# EasyEDA Pro project 铜管工装.epro

# Schematic Schematic1
Board Name: Board1; Create Date: 2025-10-13; Page Name: P1; Project Name: 铜管工装; Schematic Name: Schematic1; Update Date: 2025-10-13; Company: 嘉立创EDA; Page Size: A4; Version: V1.0
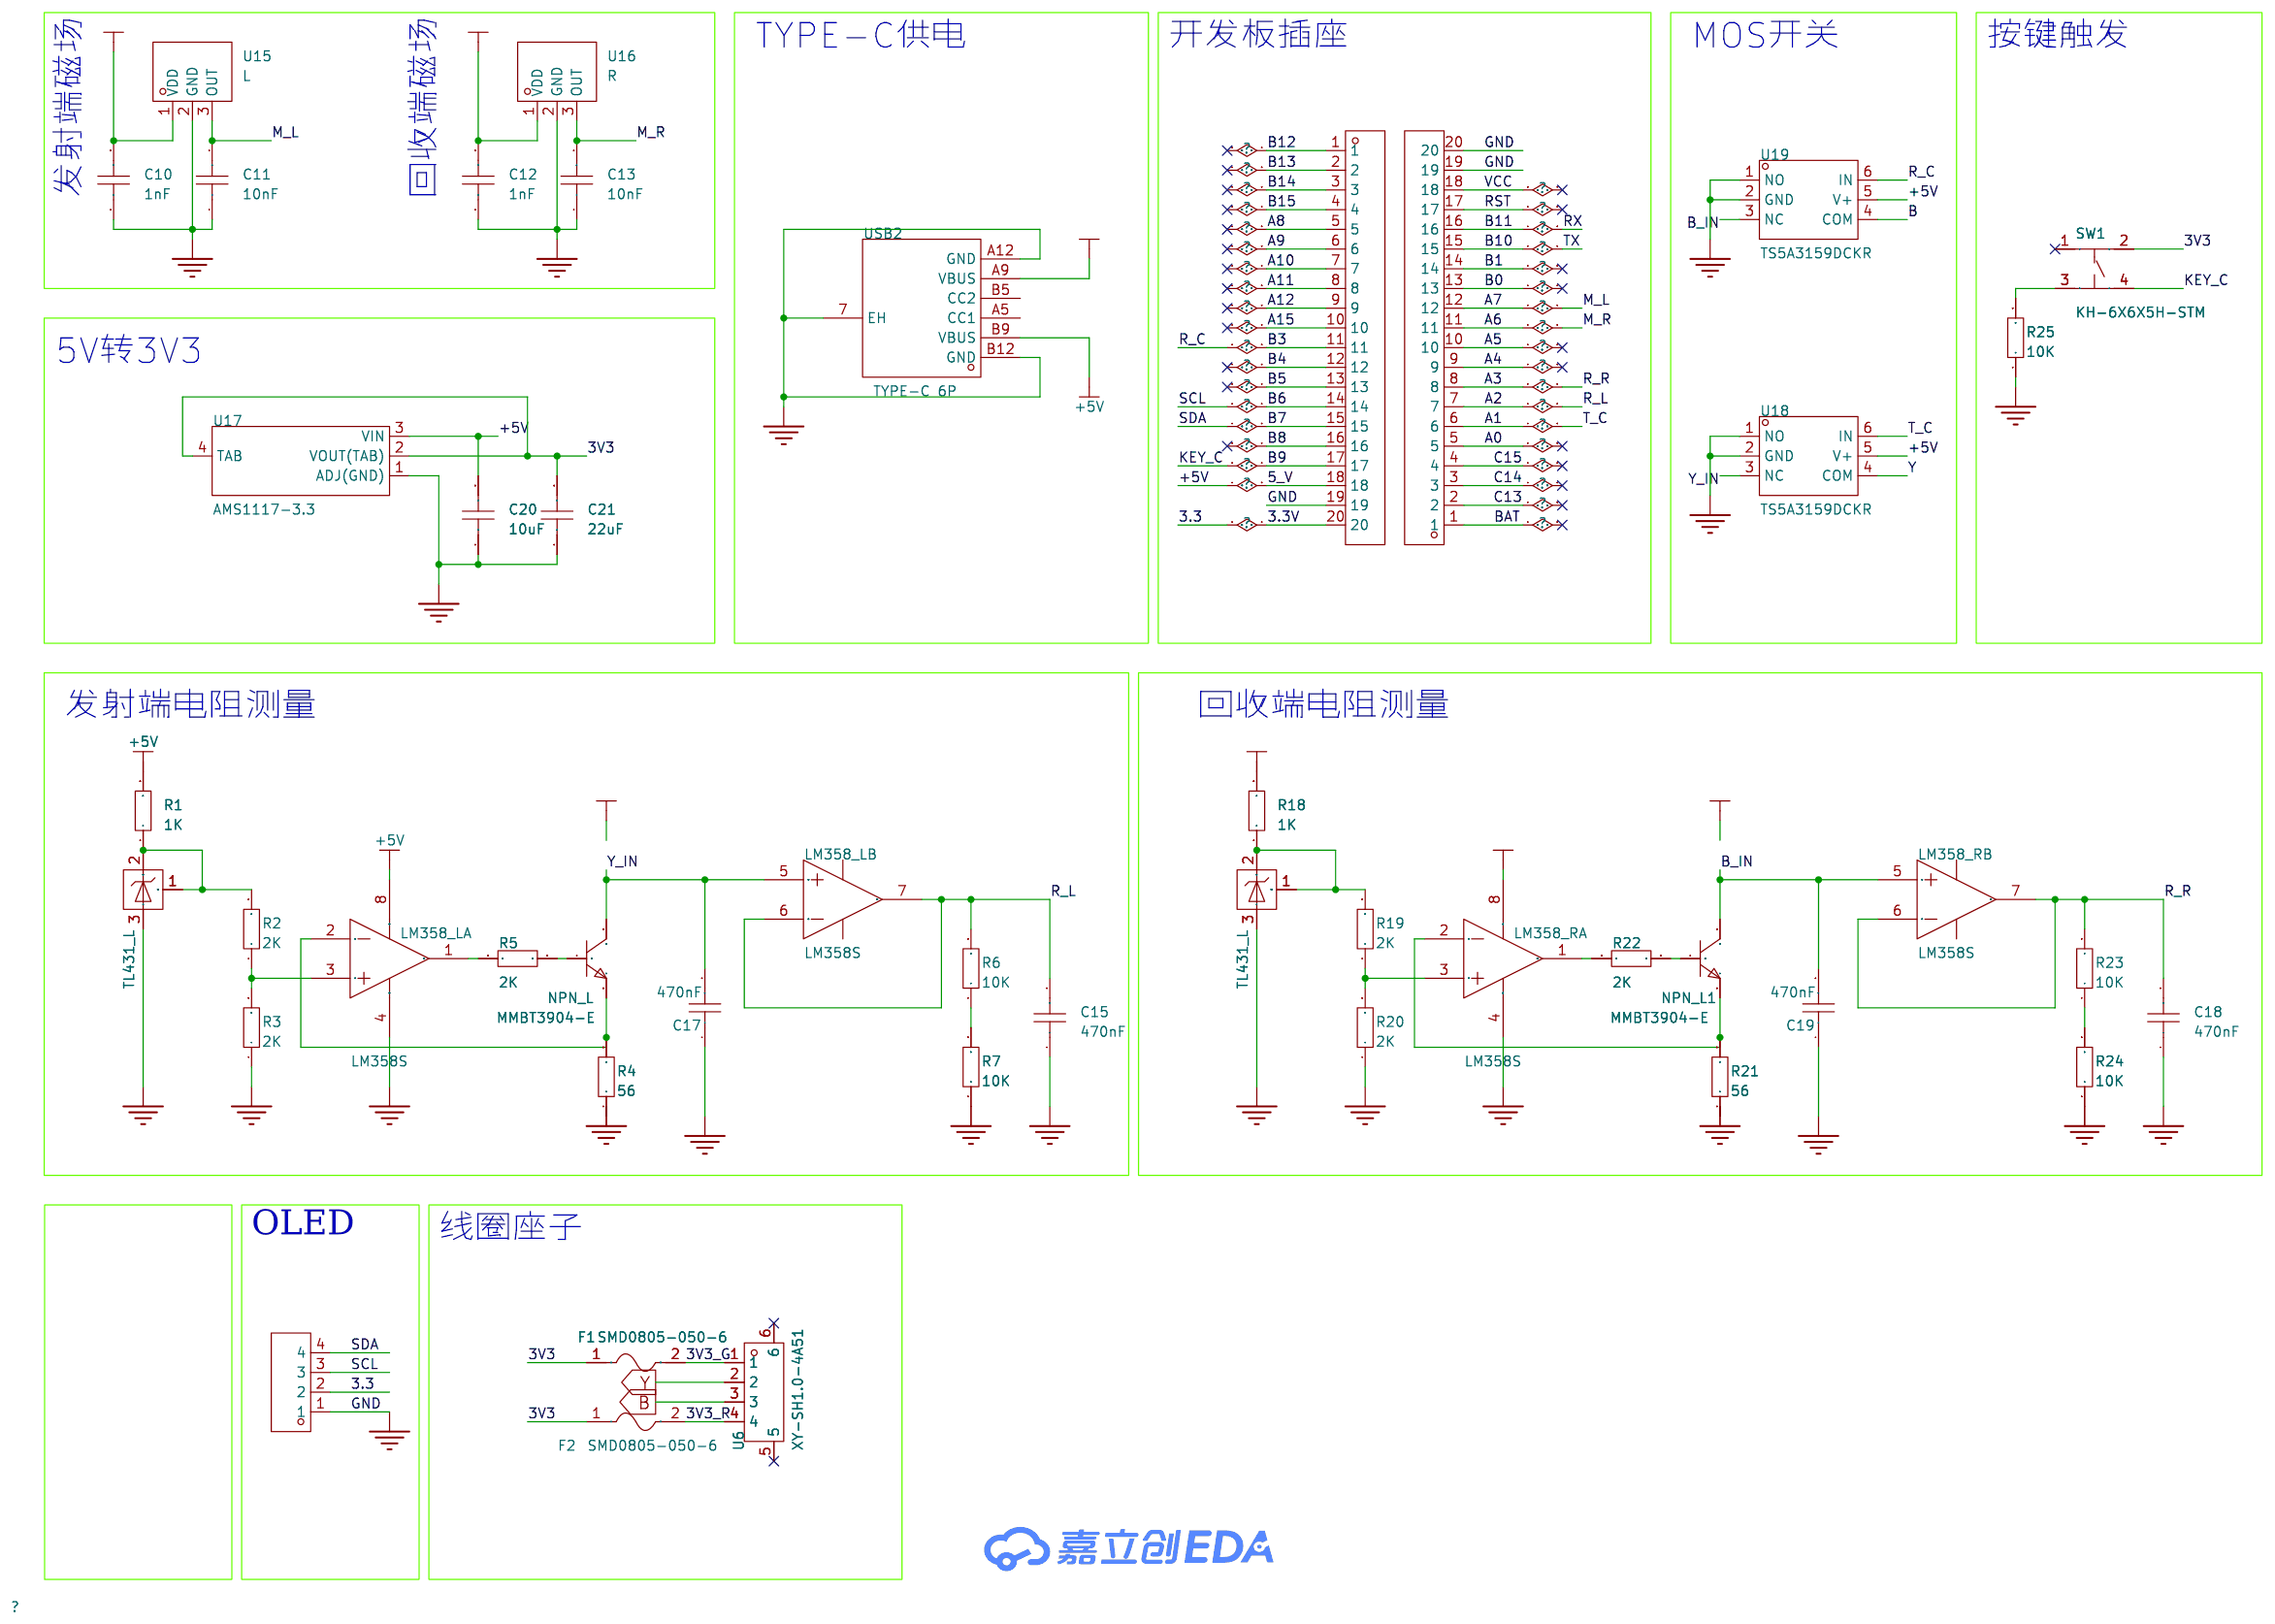
[diagram p0: schematic sheet]

## Parts
C10  1nF  [C0805]
C11  10nF  [C0805]
C12  1nF  [C0805]
C13  10nF  [C0805]
C15  470nF  [C0603]
C17  470nF  [C0603]
C18  470nF  [C0603]
C19  470nF  [C0603]
C20  10uF  [C0805]
C21  22uF  [C0805]
F1  SMD0805-050-6  [F0805]
F2  SMD0805-050-6  [F0805]
H1  2.54-1*4P母  [HDR-TH_4P-P2.54-V-F]
LM358_L  LM358S  [SOP-8_L4.9-W3.9-P1.27-LS6.0-BL]  (sections 1,2)
LM358_R  LM358S  [SOP-8_L4.9-W3.9-P1.27-LS6.0-BL]  (sections 1,2)
NPN_L  MMBT3904-E  [SOT-23-3_L2.9-W1.4-P1.90-LS2.5-BR]
NPN_L1  MMBT3904-E  [SOT-23-3_L2.9-W1.4-P1.90-LS2.5-BR]
R1  1K  [R0603]
R2  2K  [R0603]
R3  2K  [R0603]
R4  56  [R0603]
R5  2K  [R0603]
R6  10K  [R0603]
R7  10K  [R0603]
R18  1K  [R0603]
R19  2K  [R0603]
R20  2K  [R0603]
R21  56  [R0603]
R22  2K  [R0603]
R23  10K  [R0603]
R24  10K  [R0603]
R25  10K  [R0805_1]
SW1  KH-6X6X5H-STM  [SW-SMD_4P-L6.0-W6.0-P4.50-LS9.0_H5.0]
TL431_L  TL431_L  [SOT-23-3_L2.9-W1.4-P1.90-LS2.5-BR]
TL431_L1  TL431_L  [SOT-23-3_L2.9-W1.4-P1.90-LS2.5-BR]
U6  XY-SH1.0-4A51  [CONN-SMD_4P-P1.00_XY-SH1.0-4A51]
U11  KH-2.54FH-1X20P-H8.5  [HDR-TH_20P-P2.54-V-F-2]
U12  KH-2.54FH-1X20P-H8.5  [HDR-TH_20P-P2.54-V-F-2]
U15  L  [TO-92S-3_L4.1-W1.7-P1.27-L]
U16  R  [TO-92S-3_L4.1-W1.7-P1.27-L]
U17  AMS1117-3.3  [SOT-223-4_L6.5-W3.5-P2.30-LS7.0-BR]
U18  TS5A3159DCKR  [SC-70-6_L2.0-W1.3-P0.65-LS2.1-BL-1]
U19  TS5A3159DCKR  [SC-70-6_L2.0-W1.3-P0.65-LS2.1-BL-1]
USB2  TYPE-C 6P  [TYPE-C-SMD_TYPE-C-6P]

## Library data of the parts
C10-C13 C15 C17-C21 = CAP_0603: Supplier Footprint: 0603
F1 F2 = SMD0805-050-6: 耐压(Vmax):6V;最大电流(Imax):40A;保持电流(Ihold):500mA;跳闸电流(Itrip):1A;; Supplier Part: C46640983; Manufacturer: 宏嘉诚; Supplier Footprint: 0805; JLCPCB Part Class: 扩展库; Datasheet: https://item.szlcsc.com/datasheet/SMD0805-050-6/48798689.html; Supplier: LCSC; Voltage - Max: 6V; Current - Max: 40A; Hold Current: 500mA; Trip Current: 1A; Power Dissipation: 500mW; Resistance - Initial (Ri) (Min): 100mΩ; Resistance - Post Trip (R1) (Max): 850mΩ; Time to Trip(Max): 100ms; Operating Temperature: -40℃~+85℃; Length: 2.2mm; Width: 1.5mm; Height: 0.8mm
H1 = 2.54-1*4P母: 插孔结构:1x4P;间距:2.54mm;行距:-;圆孔/方孔:方孔;安装类型:直插;排数:单排;总孔位数:4P;额定电流:3A;额定电压:-;插孔方向:顶部;塑高:-;触头材质:青铜;触头镀层:-;工作温度范围:-40℃~+105℃;焊接温度(最大值):-;; LCSC Part Name: 间距:2.54mm 1x4P 直插; Supplier Part: C2718488; Manufacturer: BOOMELE(博穆精密); Supplier Footprint: 插件,P=2.54mm; Datasheet: https://atta.szlcsc.com/upload/public/pdf/source/20210301/C2718488_F4427B881E42CAA8DDB0B1C12B3A522C.pdf; Supplier: LCSC; Holes Structure: 1x4P; Pitch: 2.54mm; Circular Hole / Square Hole: 方孔; Mounting Type: 直插; Number of Rows: 单排; Number of Holes: 4P; Current Rating (Max): 3A; Holes Direction: 顶部; Contact Material: 青铜; Operating Temperature Range: -40℃~+105℃
LM358_L LM358_R = LM358S_C408270: 放大器数:双路;轨到轨:-;增益带宽积(GBP):1MHz;压摆率(SR):0.3V/us;; Supplier Part: C408270; Manufacturer: Slkor(萨科微); Supplier Footprint: SOP-8; JLCPCB Part Class: 扩展库; Datasheet: https://atta.szlcsc.com/upload/public/pdf/source/20190729/C408270_8A571363543B0DAC89A7C1628AEF28C4.pdf; Supplier: LCSC; Number of Circuits: 双路; Maximum Power Supply Range (Vdd-Vss): 36V; Gain Bandwidth Product(GBP): 1MHz; Input Offset Voltage Drift (Vos TC): 7uV/℃; Slew Rate(SR): 0.3V/us; Common Mode Rejection Ratio (CMRR): 80dB; Operating Temperature: 0℃~+70℃
NPN_L NPN_L1 = MMBT3904-E: 晶体管类型:-;集电极电流(Ic):-;集射极击穿电压(Vceo):-;功率(Pd):-;直流电流增益(hFE@Ic,Vce):-;; LCSC Part Name: 三极管(BJT); Supplier Part: C41371422; Manufacturer: MDD(辰达半导体); Supplier Footprint: SOT-23; JLCPCB Part Class: 扩展库; Datasheet: https://atta.szlcsc.com/upload/public/pdf/source/20240830/279C69FABDBFBB30A5CB11E9EEA12008.pdf; Supplier: LCSC
R1-R7 R18-R25 = Res_0603: Supplier Footprint: 0603
SW1 = KH-6X6X5H-STM: 电路结构:单刀单掷;按钮形状:圆形按钮;安装方式:立贴;开关长度:6mm;开关宽度:6mm;开关高度:5mm;带支架:不带支架;触点电流:50mA;额定电压:12V;工作寿命:8万次;; LCSC Part Name: 6*6*5mm 立贴 轻触开关; Supplier Part: C2837531; Manufacturer: kinghelm(金航标); Supplier Footprint: SMD-4P,6x6mm; JLCPCB Part Class: 扩展库; Datasheet: https://item.szlcsc.com/datasheet/KH-6X6X5H-STM/3009601.html; Supplier: LCSC; Circuit: 单刀单掷; Actuator Style: 圆形按钮; Mounting Type: 立贴; Length: 6mm; Width: 6mm; Switch Height: 5mm; with Bracket: 不带支架; Contact Current: 50mA; Voltage Rating: 12V; Actuator/Cap Color: 黑色; Termination Style: 鸥翼型; Life: 8万次
TL431_L TL431_L1 = TL431A-MS: 输出类型:可调;输入电压:-;输出电压:2.5V~36V;输出电流:100mA;精度:±0.5%;; LCSC Part Name: 电压:2.495V~36V 电流:100mA ±0.5%; Supplier Part: C19272793; Manufacturer: MSKSEMI(美森科); Supplier Footprint: SOT-23; JLCPCB Part Class: 扩展库; Datasheet: https://atta.szlcsc.com/upload/public/pdf/source/20231208/1CED24ED5F4ADB4233DAC99CE708398F.pdf; Supplier: LCSC; Output Type: 可调; Output Voltage: 2.5V~36V; Output Current: 100mA; Tolerance: ±0.5%; Temperature Coefficient: 25ppm/℃
U6 = XY-SH1.0-4A51: 插针结构:1x4P;间距:1mm;安装方式:立贴;总PIN数:4P;排数:1;每排PIN数:4;; LCSC Part Name: 间距:1.0 1x4P 立贴; Supplier Part: C19272007; Manufacturer: XYECONN(辛译); Supplier Footprint: SMD,P=1mm; JLCPCB Part Class: Extended Part; Datasheet: https://atta.szlcsc.com/upload/public/pdf/source/20231128/C6B60C64F4338683BC8BC065CCF39725.pdf; Supplier: LCSC; Pins Structure: 1x4P; Pitch: 1mm; Mounting Style: 立贴; Number of Pins: 4P; Number of Rows: 1; Number of PINs Per Row: 4
U11 U12 = KH-2.54FH-1X20P-H8.5: 插孔结构:1x20P;间距:2.54mm;行距:-;圆孔/方孔:方孔;安装类型:直插;排数:单排;总孔位数:20P;额定电流:3A;额定电压:-;插孔方向:顶部;塑高:8.5mm;工作温度范围:-40℃~+105℃;; LCSC Part Name: 间距:2.54mm 1x20P 直插; Supplier Part: C2905423; Manufacturer: kinghelm(金航标); Supplier Footprint: 插件,P=2.54mm; Datasheet: https://atta.szlcsc.com/upload/public/pdf/source/20211019/BDB673907948473CE61C8A1CF06C5BF5.pdf; Supplier: LCSC; Holes Structure: 1x20P; Pitch: 2.54mm; Circular Hole / Square Hole: 方孔; Mounting Type: 直插; Number of Rows: 单排; Number of Holes: 20P; Current Rating (Max): 3A; Holes Direction: 顶部; Insulation Height: 8.5mm; Operating Temperature Range: -40℃~+105℃
U15 U16 = HX6639IUA-D: 测位移,测角度,测磁场变化,测电流; LCSC Part Name: 高灵敏度线性霍尔元件 线性霍尔传感器; Supplier Part: C558885; Manufacturer: HUAXIN(华芯); Supplier Footprint: TO-92S; JLCPCB Part Class: 扩展库; Datasheet: https://atta.szlcsc.com/upload/public/pdf/source/20240416/3C8E9329C72945CE95B7A864F22507C2.pdf; Supplier: LCSC; supply voltage: 2.8V~6V; Operating Temperature: -40℃~+125℃
U17 = AMS1117-3.3_C347222: 输出类型:固定;工作电压:12V;输出电压:3.3V;输出电流:1A;电源纹波抑制比(PSRR):60dB@(120Hz);输出极性:正极;; LCSC Part Name: 输出:3.3V 电流:1A 耐压:12V; Supplier Part: C347222; Manufacturer: UMW(友台半导体); Supplier Footprint: SOT-223; JLCPCB Part Class: 扩展库; Datasheet: https://item.szlcsc.com/datasheet/AMS1117-3.3/323882.html; Supplier: LCSC; Output Type: 固定; Voltage - Supply: 12V; Output Voltage: 3.3V; Output Current: 1A; Power Supply Rejection Ratio (PSRR): 60dB@(120Hz); Voltage Dropout: 1.3V@(1A); Features: 过流保护; Output Configuration: 正极; Number of Outputs: 1
U18 U19 = TS5A3159DCKR: 开关电路:2:1;通道数:1;导通电阻(Ron):1Ω;; LCSC Part Name: TS5A3159 1-Q SPDT 模拟开关; Supplier Part: C46388; Manufacturer: TI(德州仪器); Supplier Footprint: SC-70-6(SOT-363); JLCPCB Part Class: 扩展库; Datasheet: https://www.ti.com/cn/lit/gpn/ts5a3159; Supplier: LCSC; Switch Circuit: 2:1; Number of Channels: 1; Voltage - Supply: 1.65V~5.5V; Turn-on time: 20ns; Ron: 1Ω; Turn-off time: 15ns; Operating Temperature: -40℃~+85℃; Con: 84pF; Bandwidth: 100MHz
USB2 = TYPE-C 6P: 连接器类型:Type-C;标准:USB 3.1;公母:母;安装方式:卧贴;触点数量:6P;端口数量:1;额定电流 - 电源:5A;工作温度范围:-40℃~+85℃;; LCSC Part Name: Type-C 母 卧贴; Supplier Part: C456012; Manufacturer: SHOU HAN(首韩); Supplier Footprint: SMD; JLCPCB Part Class: 扩展库; Datasheet: https://atta.szlcsc.com/upload/public/pdf/source/20201203/C456012_B13F72044DF846EDBE9BDD0D1D3CD166.pdf; Supplier: LCSC; Connector Type: Type-C; Standard: USB 3.1; Gender: 母; Mounting Style: 卧贴; Number of Contacts: 6P; Number of Ports: 1; Current Rating - Power (Max): 5A; Operating Temperature Range: -40℃~+85℃; Rated Voltage (Max): 20V; Connect-Disconnect Life: 3千次; Core Colour: 黑色

## Nets
3V3: C10.2 C12.2 C21.2 F1.1 F2.1 SW1.2 U15.1(VDD) U16.1(VDD) U17.2(VOUT(TAB)) U17.4(TAB)
3V3_G: F1.2 U6.1
3V3_R: F2.2 U6.4
5V: LM358_R.8(VCC) R18.2 USB2.A9(VBUS)
+5V: C20.2 LM358_L.8(VCC) R1.2 U11.18 U17.3(VIN) U18.5(V+) U19.5(V+) USB2.B9(VBUS)
GND: C10.1 C11.1 C12.1 C13.1 C15.1 C17.1 C18.1 C19.1 C20.1 C21.1 H1.1 LM358_L.4(GND) LM358_R.4(GND) R3.1 R4.1 R7.1 R20.1 R21.1 R24.1 R25.1 TL431_L.3(A) TL431_L1.3(A) U11.19 U12.19 U12.20 U15.2(GND) U16.2(GND) U17.1(ADJ(GND)) U18.1(NO) U18.2(GND) U19.1(NO) U19.2(GND) USB2.7(EH) USB2.A12(GND) USB2.B12(GND)
VCC: U12.18
3.3: H1.2 U11.20
A0: U12.5
A1: U12.6 U18.6(IN)
A2: C15.2 LM358_L.6(IN2-) LM358_L.7(OUT2) R6.2 U12.7
A3: C18.2 LM358_R.6(IN2-) LM358_R.7(OUT2) R23.2 U12.8
A4: U12.9
A5: U12.10
A6: C13.2 U12.11 U16.3(OUT)
A7: C11.2 U12.12 U15.3(OUT)
A8: U11.5
A9: U11.6
A10: U11.7
A11: U11.8
A12: U11.9
A15: U11.10
B: U6.3 U19.4(COM)
B0: U12.13
B1: U12.14
B3: U11.11 U19.6(IN)
B4: U11.12
B5: U11.13
B6: H1.3 U11.14
B7: H1.4 U11.15
B8: U11.16
B9: SW1.4 U11.17
B10: U12.15
B11: U12.16
B12: U11.1
B13: U11.2
B14: U11.3
B15: U11.4
B_IN: C19.2 LM358_R.5(IN2+) NPN_L1.3(C) U19.3(NC)
BAT: U12.1
C13: U12.2
C14: U12.3
C15: U12.4
RST: U12.17
Y: U6.2 U18.4(COM)
Y_IN: C17.2 LM358_L.5(IN2+) NPN_L.3(C) U18.3(NC)
$1N2206: NPN_L.1(B) R5.2
$1N2855: R6.1 R7.2
$1N3044: LM358_L.1(OUT1) R5.1
$1N49015: R1.1 R2.2 TL431_L.1(REF) TL431_L.2(C)
$1N49740: NPN_L1.1(B) R22.2
$1N49741: R23.1 R24.2
$1N49768: LM358_R.1(OUT1) R22.1
$1N49771: R18.1 R19.2 TL431_L1.1(REF) TL431_L1.2(C)
$1N53499: LM358_L.2(IN1-) NPN_L.2(E) R4.2
$1N53519: LM358_L.3(IN1+) R2.1 R3.2
$1N53536: LM358_R.3(IN1+) R19.1 R20.2
$1N53543: LM358_R.2(IN1-) NPN_L1.2(E) R21.2
$1N65504: R25.2 SW1.3

Not connected (* = marked no-connect by the designer): SW1 1*; U6 5* 6*; USB2 A5(CC1) B5(CC2)

## Notes on the sheet
- TYPE-C供电
- 开发板插座
- MOS开关
- 按键触发
- 发射端磁场
- 回收端磁场
- 5V转3V3
- 发射端电阻测量
- 回收端电阻测量
- OLED
- 线圈座子

# Board PCB1
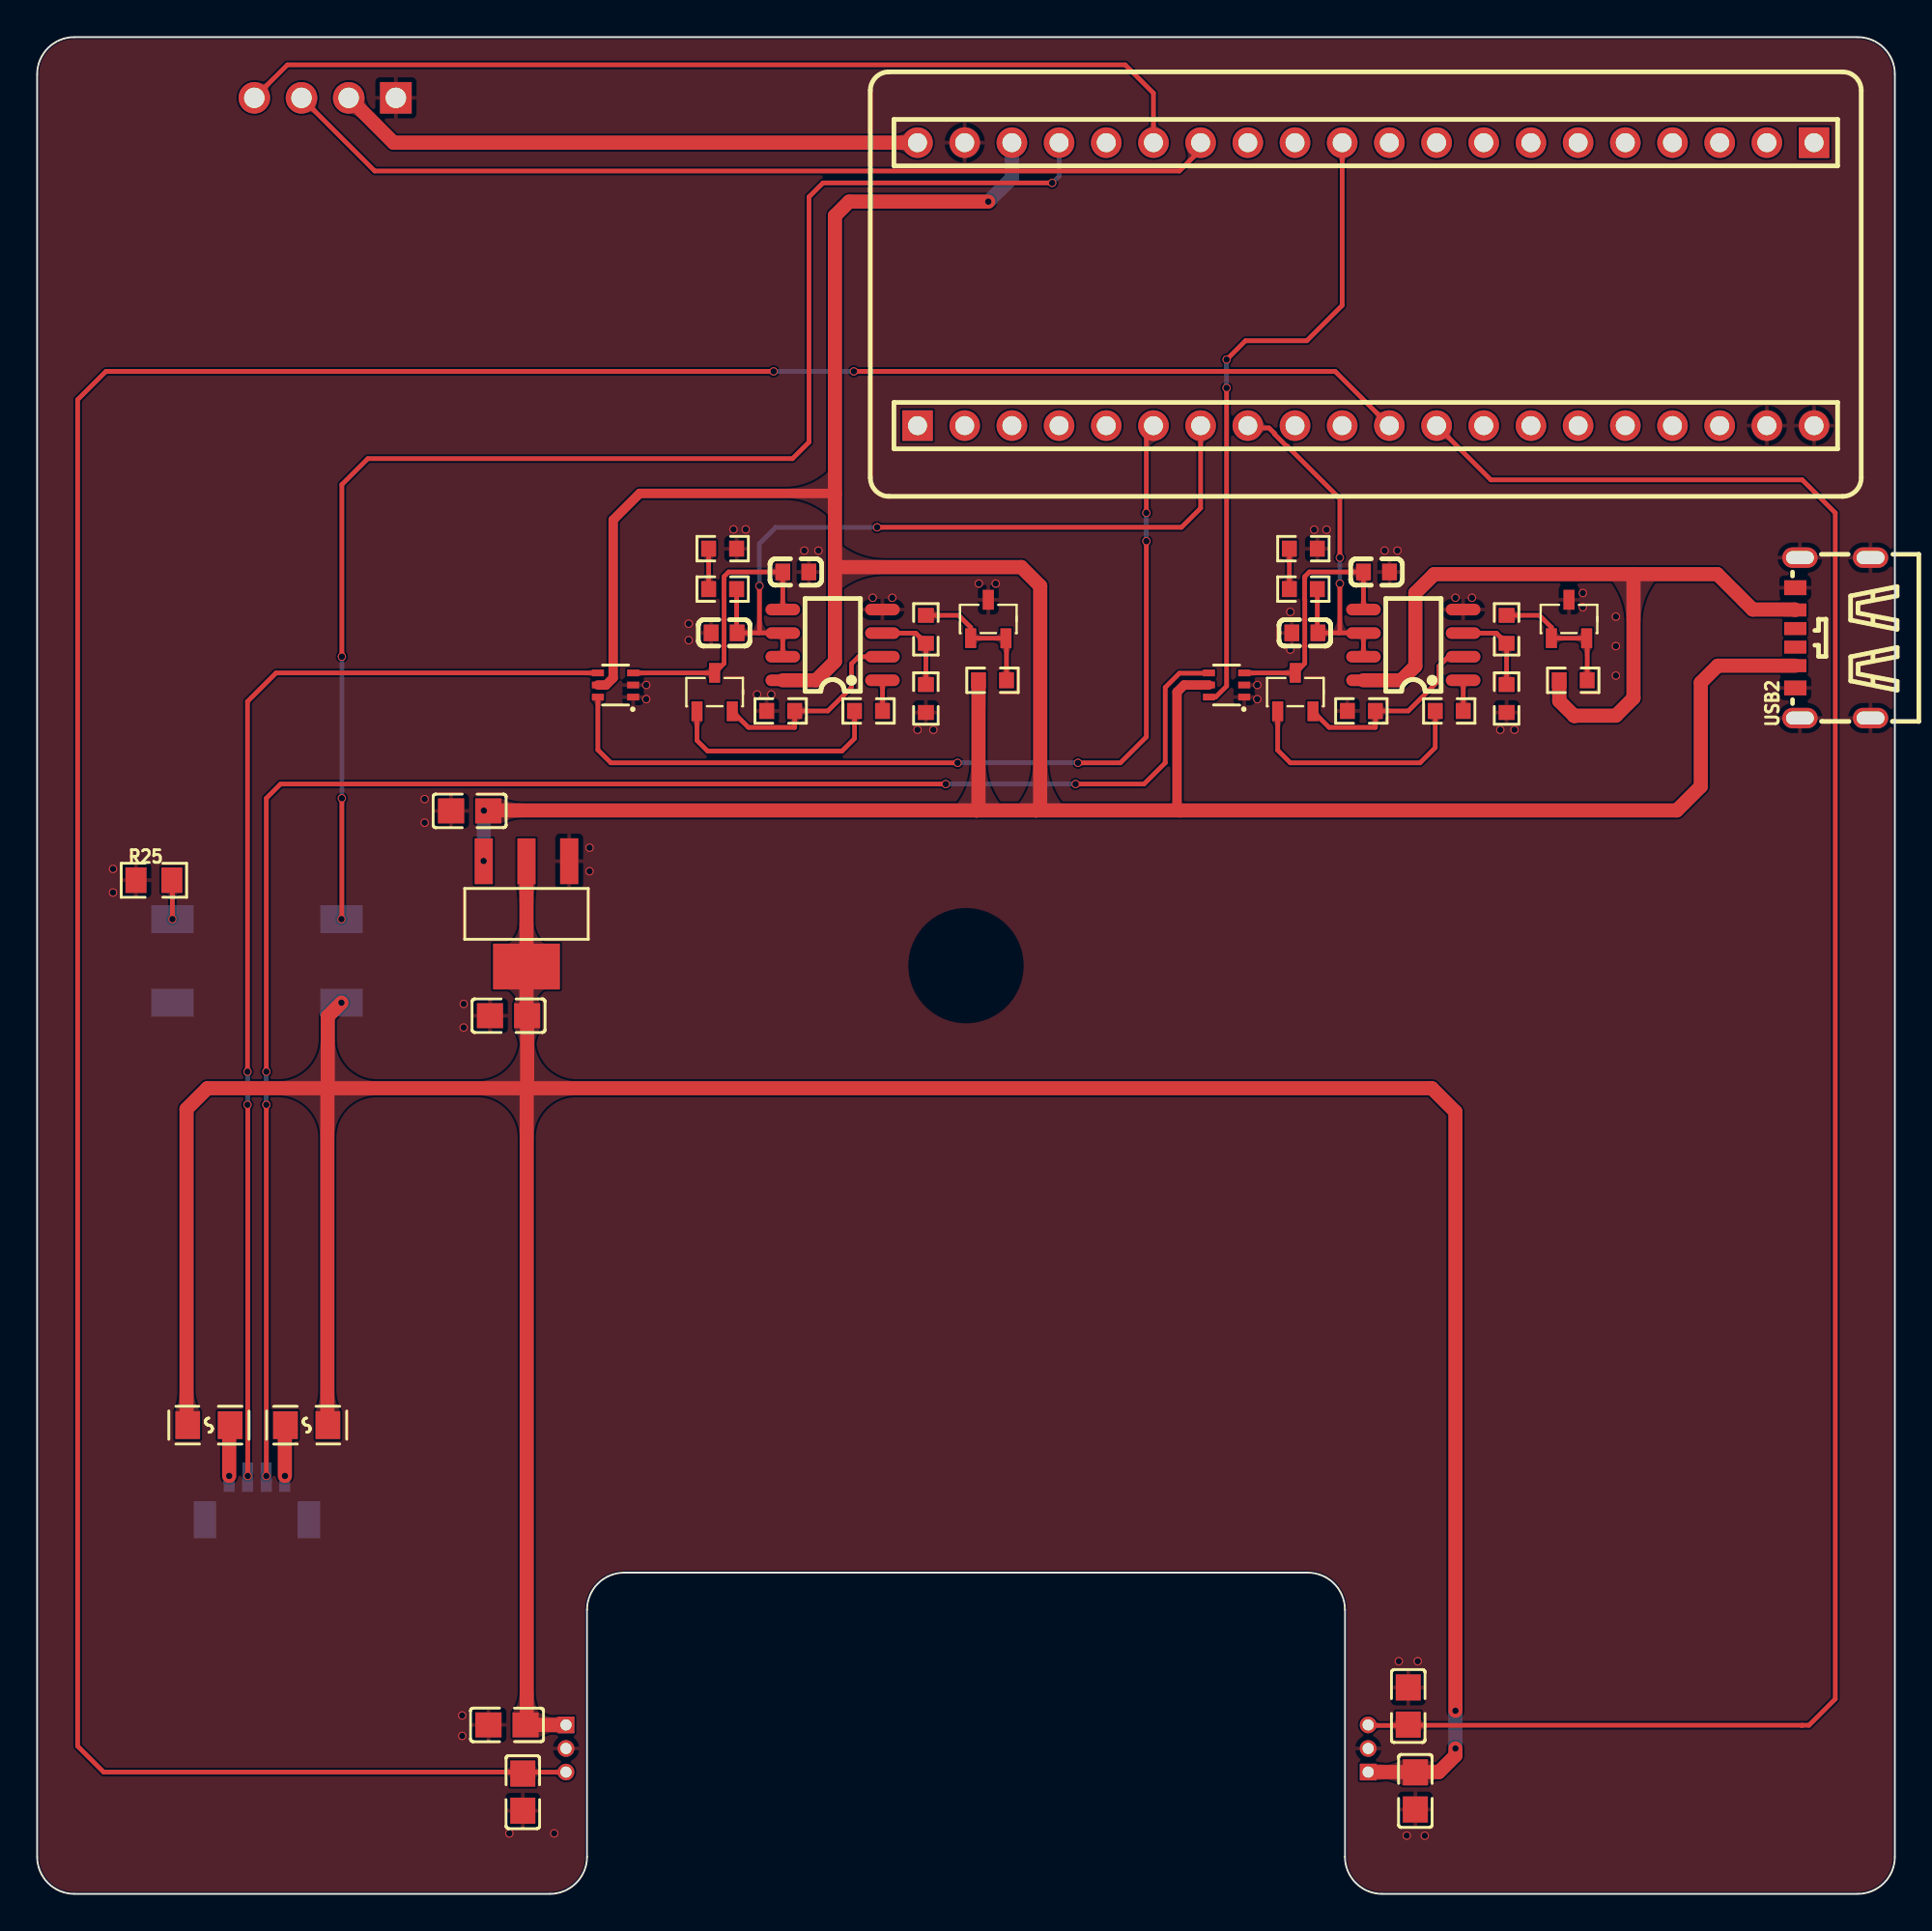
[diagram p1: board, top side]
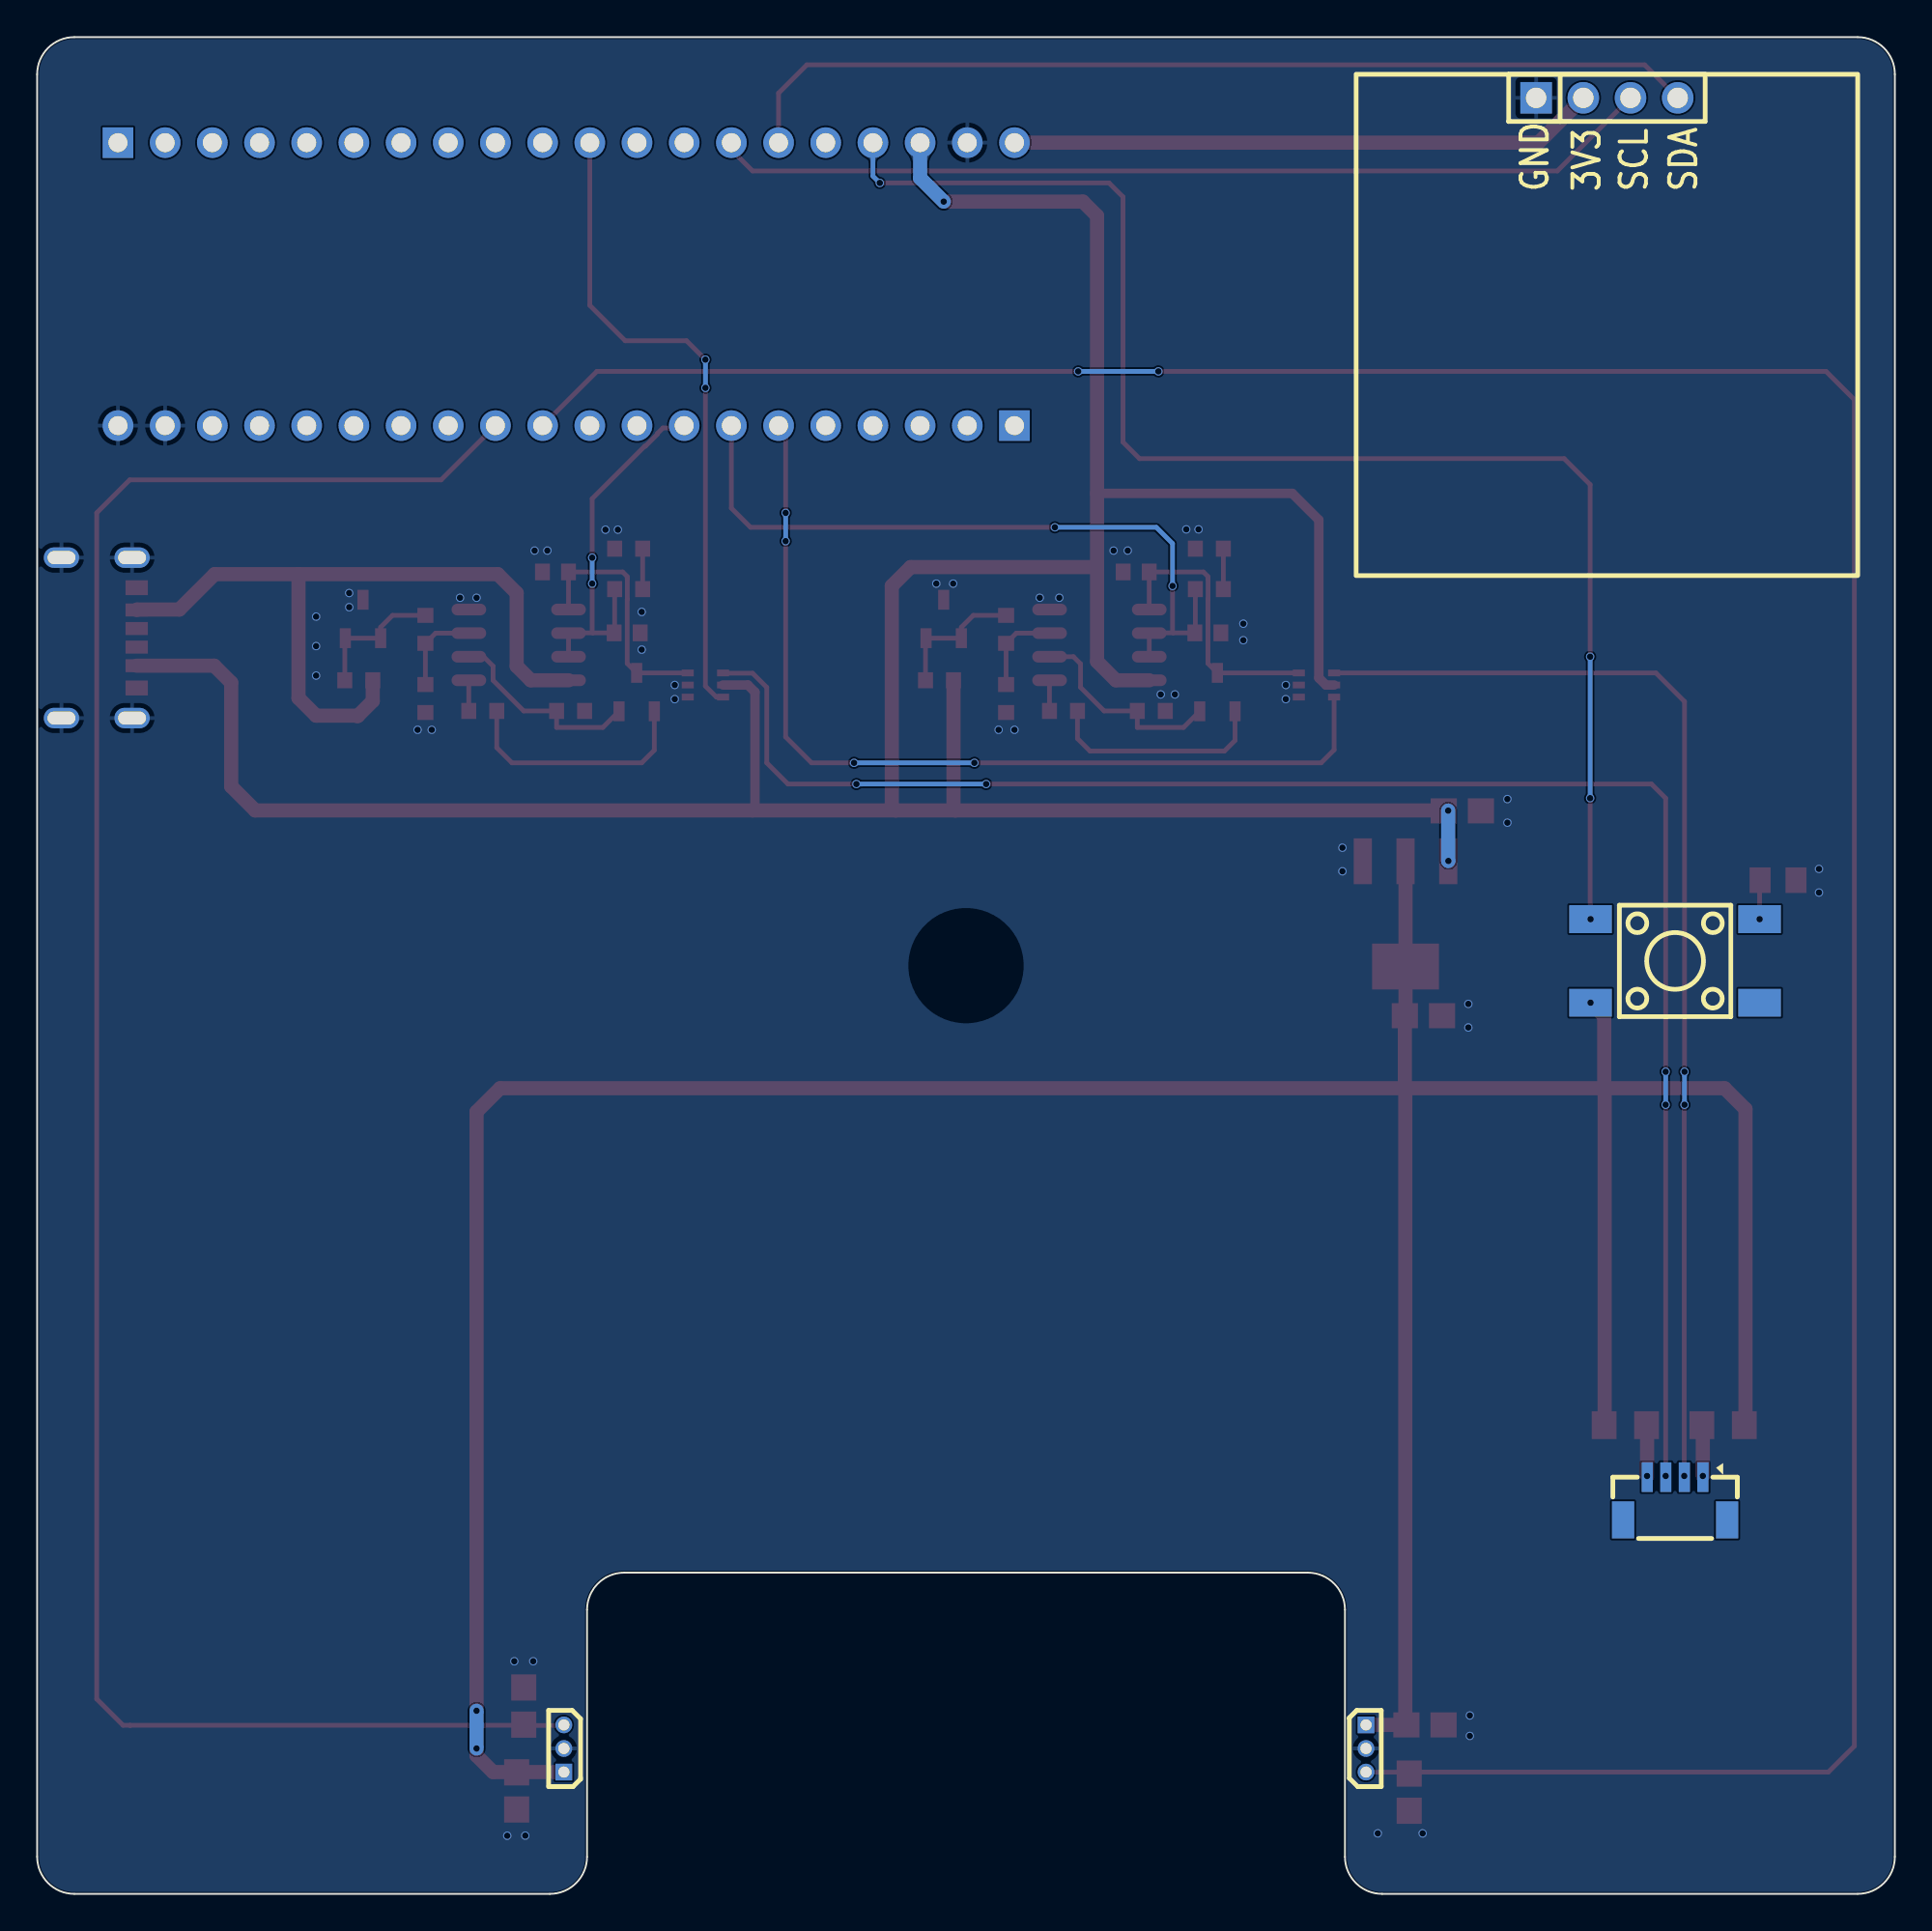
[diagram p2: board, bottom side, seen from below]

Outline 100 x 100 mm; copper layers: Top Layer, Bottom Layer. Coordinates in mm from the lower left corner of the outline.
Outline path: 0,98 arc(0.59,99.41) 2,100 98,100 arc(99.41,99.41) 100,98 100,2 arc(99.41,0.59) 98,0 72.4,0 arc(70.99,0.59) 70.4,2 70.4,15.3 arc(69.81,16.71) 68.4,17.3 31.6,17.3 arc(30.19,16.71) 29.6,15.3 29.6,2 arc(29.01,0.59) 27.6,0 2,0 arc(0.59,0.59) 0,2 0,98
Stack: Top Layer 0.035mm / Dielectric1 1.51mm FR4 er 4.5 / Bottom Layer 0.035mm

## Design rules (mm)
template: 自定义配置
spacing copperThickness1oz (default): track to track 0.102, other pairs 0.152 to 0.3
spacing copperThickness2oz: track to track 0.203, other pairs 0.152 to 0.3
track width copperThickness1oz (default): min 0.127, default 0.254, max 2.54
track width copperThickness2oz: min 0.127, default 0.254, max 2.54
differential pair differentialPair (default): width min 0.127, default 0.254, max 2.54; gap min 0.152, default 0.152
via viaSize (default): diameter min 0.1, default 0.45, max 10; hole min 0.1, default 0.35, max 6.3

## Placement (name value [footprint] x y rotation side)
C10  1nF  [C0805]  25.29 9.1 0 top
C11  10nF  [C0805]  73.81 10.12 270 top
C12  1nF  [C0805]  74.19 5.54 90 top
C13  10nF  [C0805]  26.14 5.48 90 top
C15  470nF  [C0603]  36.98 67.91 0 top
C17  470nF  [C0603]  40.84 71.19 180 top
C18  470nF  [C0603]  68.24 67.91 0 top
C19  470nF  [C0603]  72.1 71.19 180 top
C20  10uF  [C0805]  23.28 58.33 0 top
C21  22uF  [C0805]  25.38 47.3 0 top
F1  SMD0805-050-6  [F0805]  9.25 25.24 0 top
F2  SMD0805-050-6  [F0805]  14.51 25.24 180 top
H1  2.54-1*4P母  [HDR-TH_4P-P2.54-V-F]  15.5 96.73 180 bottom
LM358_L  LM358S  [SOP-8_L4.9-W3.9-P1.27-LS6.0-BL]  42.82 67.27 90 top
LM358_R  LM358S  [SOP-8_L4.9-W3.9-P1.27-LS6.0-BL]  74.08 67.27 90 top
NPN_L  MMBT3904-E  [SOT-23-3_L2.9-W1.4-P1.90-LS2.5-BR]  36.47 64.73 270 top
NPN_L1  MMBT3904-E  [SOT-23-3_L2.9-W1.4-P1.90-LS2.5-BR]  67.73 64.73 270 top
R1  1K  [R0603]  51.43 65.36 180 top
R2  2K  [R0603]  47.84 68.1 90 top
R3  2K  [R0603]  47.84 64.38 90 top
R4  56  [R0603]  40.02 63.71 0 top
R5  2K  [R0603]  44.75 63.71 180 top
R6  10K  [R0603]  36.9 70.27 0 top
R7  10K  [R0603]  36.9 72.45 180 top
R18  1K  [R0603]  82.69 65.36 180 top
R19  2K  [R0603]  79.1 68.1 90 top
R20  2K  [R0603]  79.1 64.38 90 top
R21  56  [R0603]  71.28 63.71 0 top
R22  2K  [R0603]  76.01 63.71 180 top
R23  10K  [R0603]  68.16 70.27 0 top
R24  10K  [R0603]  68.16 72.45 180 top
R25  10K  [R0805_1]  6.29 54.6 0 top
SW1  KH-6X6X5H-STM  [SW-SMD_4P-L6.0-W6.0-P4.50-LS9.0_H5.0]  11.83 50.25 0 bottom
TL431_L  TL431_L  [SOT-23-3_L2.9-W1.4-P1.90-LS2.5-BR]  51.2 68.66 270 top
TL431_L1  TL431_L  [SOT-23-3_L2.9-W1.4-P1.90-LS2.5-BR]  82.46 68.66 270 top
U6  XY-SH1.0-4A51  [CONN-SMD_4P-P1.00_XY-SH1.0-4A51]  11.83 21.29 0 bottom
U11  KH-2.54FH-1X20P-H8.5  [HDR-TH_20P-P2.54-V-F-2]  71.52 94.32 180 top
U12  KH-2.54FH-1X20P-H8.5  [HDR-TH_20P-P2.54-V-F-2]  71.52 79.08 0 top
U15  L  [TO-92S-3_L4.1-W1.7-P1.27-L]  71.65 7.83 90 bottom
U16  R  [TO-92S-3_L4.1-W1.7-P1.27-L]  28.47 7.83 270 bottom
U17  AMS1117-3.3  [SOT-223-4_L6.5-W3.5-P2.30-LS7.0-BR]  26.34 52.78 90 top
U18  TS5A3159DCKR  [SC-70-6_L2.0-W1.3-P0.65-LS2.1-BL-1]  31.13 65.11 90 top
U19  TS5A3159DCKR  [SC-70-6_L2.0-W1.3-P0.65-LS2.1-BL-1]  64.03 65.11 90 top
USB2  TYPE-C 6P  [TYPE-C-SMD_TYPE-C-6P]  96.67 67.65 90 top

## Footprints (pads in the part's own frame, mm; a bottom-side part is the same pattern mirrored in y, then rotated)
C0603
  rect 0.8x0.9 smd: 1(-0.7,0) 2(0.7,0)
C0805
  rect 1.41x1.35 smd: 1(-1,0) 2(1,0)
CONN-SMD_4P-P1.00_XY-SH1.0-4A51
  rect 0.6x1.6 smd: 1(-1.5,-1.15) 2(-0.5,-1.15) 3(0.5,-1.15) 4(1.5,-1.15)
  rect 1.2x2 smd: 5(2.8,1.15) 6(-2.8,1.15)
F0805
  rect 1.335x1.5 smd: 1(-1.143,0) 2(1.143,0)
HDR-TH_4P-P2.54-V-F
  rect 1.7x1.7 hole 1.1: 1(-3.81,0)
  round 1.7 hole 1.1: 2(-1.27,0) 3(1.27,0) 4(3.81,0)
HDR-TH_20P-P2.54-V-F-2
  rect 1.65x1.65 hole 1.02: 1(-24.13,0)
  round 1.65 hole 1.02: 2(-21.59,0) 3(-19.05,0) 4(-16.51,0) 5(-13.97,0) 6(-11.43,0) 7(-8.89,0) 8(-6.35,0) 9(-3.81,0) 10(-1.27,0) 11(1.27,0) 12(3.81,0) 13(6.35,0) 14(8.89,0) 15(11.43,0) 16(13.97,0) 17(16.51,0) 18(19.05,0) 19(21.59,0) 20(24.13,0)
R0603
  rect 0.806x0.864 smd: 1(-0.753,0) 2(0.753,0)
R0805_1
  rect 1.133x1.377 smd: 1(-0.966,0) 2(0.966,0)
SC-70-6_L2.0-W1.3-P0.65-LS2.1-BL-1
  rect 0.364x0.65 smd: 1(-0.65,-0.95) 2(0,-0.95) 3(0.65,-0.95) 4(0.65,0.95) 5(0,0.95) 6(-0.65,0.95)
SOP-8_L4.9-W3.9-P1.27-LS6.0-BL
  oval 0.63x1.865 smd: 1(-1.905,-2.683) 2(-0.635,-2.683) 3(0.635,-2.683) 4(1.905,-2.683) 5(1.905,2.683) 6(0.635,2.683) 7(-0.635,2.683) 8(-1.905,2.683)
SOT-23-3_L2.9-W1.4-P1.90-LS2.5-BR
  rect 1.07x0.6 smd: 1(1.035,-0.95) 2(1.035,0.95) 3(-1.035,0)
SOT-223-4_L6.5-W3.5-P2.30-LS7.0-BR
  rect 2.47x0.98 smd: 1(2.835,-2.3) 2(2.835,0) 3(2.835,2.3)
  rect 2.47x3.6 smd: 4(-2.835,0)
SW-SMD_4P-L6.0-W6.0-P4.50-LS9.0_H5.0
  rect 2.3x1.5 smd: 1(-4.55,2.25) 2(4.55,2.25) 3(-4.55,-2.25) 4(4.55,-2.25)
TO-92S-3_L4.1-W1.7-P1.27-L
  rect 0.9x0.9 hole 0.6: 1(-1.27,0)
  round 0.9 hole 0.6: 2(0,0) 3(1.27,0)
TYPE-C-SMD_TYPE-C-6P
  oval 1.1x1.9 hole 0.7x1.5: 7(-4.32,1.775) 7(-4.32,-2.025) 7(4.32,1.775) 7(4.32,-2.025)
  rect 0.7x1.2 smd: A5(-0.5,2.025) A9(1.5,2.025) B5(0.5,2.025) B9(-1.5,2.025)
  rect 0.8x1.2 smd: A12(2.7,2.025) B12(-2.7,2.025)

## Nets
As in the schematic.

Pads without a net: SW1 1; U6 5 6; USB2 A5 B5

## Via types
v1: diameter 0.45, hole 0.35, Top Layer to Bottom Layer, 82 vias

## Routing (per net, layer and track width the routed paths; a pad name or vN(x,y) marks a point on that pad's centre or on a via; arc(x,y) is an arc through that point)
3V3: length 198.2
  Top Layer w0.762: v1(16.38,48) 15.64,47.26 15.64,43.39 ; 15.62,25.1 15.62,43.37 15.64,43.39 ; 15.64,43.39 9.16,43.39 8.04,42.27 8.04,25.1 ; 15.64,43.39 26.3,43.39 26.35,43.44 ; U16.1 C10.2 26.35,9.16 26.35,43.44 ; U17.2 26.34,47.33 C21.2 26.38,43.47 26.35,43.44 ; 26.35,43.44 26.41,43.39 75.08,43.39 76.35,42.12 v1(76.35,9.86) ; U15.1 75.46,6.56 76.35,7.45 v1(76.35,7.83) ; 71.6,6.56 71.65,6.56
  Bottom Layer w0.762: v1(76.35,7.83) v1(76.35,9.86)
3V3_G: length 2.6
  Top Layer w0.762: 10.33,25.1 10.34,25.09 v1(10.34,22.51)
3V3_R: length 2.6
  Top Layer w0.762: v1(13.34,22.51) 13.34,25.1
5V: length 41.3
  Top Layer w0.762: USB2.A9 94.62,69.17 92.35,69.17 90.44,71.08 85.93,71.08 ; 85.93,71.08 85.93,64.41 84.98,63.46 82.73,63.46 ; 85.93,71.08 75.2,71.08 74.19,70.06 74.19,66.12 73.43,65.36 LM358_R.8 ; 82.73,63.46 81.93,64.25 81.93,65.36 ; 82.73,63.46 82.76,63.43
+5V: length 180.4
  Top Layer w0.508: 61.5,58.35 61.36,58.49 61.36,64.73 61.74,65.11 U19.5 ; 30.18,65.11 30.63,65.11 31.01,65.49 31.01,74 32.44,75.43 42.95,75.43
  Top Layer w0.762: 42.95,71.46 42.95,90.38 43.71,91.14 v1(51.2,91.14) ; 42.95,71.46 52.98,71.46 53.99,70.44 53.99,58.57 53.78,58.35 ; 42.95,71.46 42.95,66.38 41.93,65.36 LM358_L.8 ; 53.78,58.35 88.26,58.35 89.55,59.65 89.55,65.23 90.47,66.15 USB2.B9 ; 53.78,58.35 50.57,58.35 ; v1(24.05,58.34) 24.06,58.35 50.57,58.35 ; 50.57,58.35 50.67,58.45 R1.2
  Bottom Layer w0.762: v1(51.2,91.14) 52.47,92.41 52.47,94.32 ; v1(24.03,55.63) 24.05,55.64 v1(24.05,58.34)
GND:
  vias: v1(4.08,55.2) v1(4.08,53.93) v1(20.86,58.96) v1(20.86,57.69) v1(22.96,47.93) v1(22.96,46.66) v1(22.88,9.61) v1(22.88,8.51) v1(25.42,3.26) v1(27.83,3.26) v1(29.74,56.34) v1(29.74,55.07) v1(32.79,65.11) v1(32.79,64.35) v1(35.07,68.41) v1(35.07,67.52) v1(37.48,73.49) v1(38.14,73.49) v1(38.75,64.6) v1(39.52,64.6) v1(41.29,72.35) v1(42.06,72.35) v1(44.98,69.81) v1(46.03,69.81) v1(47.39,62.69) v1(48.25,62.69) v1(50.69,70.57) v1(51.6,70.57) v1(65.68,65.11) v1(65.68,64.35) v1(67.46,69.04) v1(67.46,67.01) v1(68.74,73.47) v1(69.41,73.47) v1(72.54,72.35) v1(73.22,72.35) v1(73.3,12.53) v1(73.72,3.14) v1(74.31,12.53) v1(74.7,3.13) v1(76.35,69.81) v1(77.24,69.81) v1(78.76,62.69) v1(79.52,62.69) v1(83.2,70.06) v1(83.2,69.3) v1(84.98,68.79) v1(84.98,67.2) v1(84.98,65.62)
3.3: length 31.6
  Top Layer w0.762: 47.39,94.32 19.18,94.32 H1.2
A1: length 50.2
  Top Layer w0.254: v1(59.71,74.38) 59.71,78.7 U12.6 ; v1(59.71,72.85) 59.71,62.31 58.31,60.92 v1(56.03,60.92) ; 30.18,64.46 30.18,61.61 30.88,60.92 v1(49.55,60.92)
  Bottom Layer w0.254: v1(59.71,72.85) v1(59.71,74.38) ; v1(49.55,60.92) v1(56.03,60.92)
A2: length 39.9
  Top Layer w0.254: U12.7 62.63,74.63 61.6,73.6 v1(45.22,73.6) ; v1(38.88,70.44) 38.88,67.95 38.85,67.91 ; 38.85,67.91 C15.2 37.65,67.94 R6.2 ; 38.85,67.91 40.12,67.91 LM358_L.6 40.14,66.63
  Bottom Layer w0.254: v1(38.88,70.44) 38.88,72.73 39.75,73.6 v1(45.22,73.6)
A3: length 19.9
  Top Layer w0.254: v1(70.12,71.97) 70.12,75.14 67.29,77.97 67.25,77.97 66.61,78.62 66.61,78.66 66.31,78.95 65.3,78.95 U12.8 ; 70.08,67.91 70.12,67.95 v1(70.12,70.57) ; 70.08,67.91 71.38,67.91 LM358_R.6 71.4,66.63 ; 70.08,67.91 C18.2 68.91,67.94 68.91,70.27
  Bottom Layer w0.254: v1(70.12,70.57) v1(70.12,71.97)
A6: length 171.8
  Top Layer w0.254: 26.65,6.56 26.65,6.56 28.47,6.56 ; 26.65,6.56 3.58,6.56 2.18,7.96 2.18,80.47 3.7,82 v1(39.64,82) ; v1(43.96,82) 69.87,82 72.79,79.08
  Bottom Layer w0.254: v1(39.64,82) v1(43.96,82)
A7: length 113
  Top Layer w0.254: 75.33,79.08 78.25,76.16 95.02,76.16 96.79,74.38 96.79,10.5 95.38,9.08 95,9.08 ; 94.99,9.06 95,9.08 ; 95,9.08 73.58,9.08 73.57,9.07 71.66,9.07
B: length 92.4
  Top Layer w0.254: v1(12.34,22.51) v1(12.34,42.5) ; v1(55.9,59.77) 59.58,59.77 60.73,60.92 60.73,64.98 61.49,65.74 63.06,65.74 63.08,65.76 ; v1(48.91,59.77) 13.1,59.77 12.34,59.01 v1(12.34,44.28)
  Bottom Layer w0.254: v1(12.34,42.5) v1(12.34,44.28) ; v1(48.91,59.77) v1(55.9,59.77)
B3: length 35
  Top Layer w0.254: v1(64.03,81.11) 64.03,65.05 63.44,64.46 U19.6 ; U11.11 70.25,85.55 68.35,83.65 65.04,83.65 v1(64.03,82.63)
  Bottom Layer w0.254: v1(64.03,82.63) v1(64.03,81.11)
B6: length 50.9
  Top Layer w0.254: H1.3 18.17,92.79 61.49,92.79 62.63,93.94 62.63,94.32
B7: length 52.4
  Top Layer w0.254: H1.4 13.47,98.51 58.57,98.51 60.09,96.98 60.09,94.32
B9: length 78.4
  Top Layer w0.254: v1(16.38,52.5) 16.4,52.52 v1(16.4,59.01) ; v1(16.4,66.63) 16.4,75.9 17.8,77.3 40.66,77.3 41.55,78.19 41.55,91.4 42.3,92.15 v1(54.64,92.15)
  Bottom Layer w0.254: v1(16.4,66.63) v1(16.4,59.01) ; v1(54.64,92.15) 55.01,92.52 U11.17
B_IN: length 13.4
  Top Layer w0.254: LM358_R.5 71.4,69.17 C19.2 68.48,71.19 68.24,70.95 68.24,70.83 68.23,70.82 68.23,69.72 68.24,69.72 68.24,66.27 NPN_L1.3 67.72,65.76 64.98,65.76
Y: length 61.2
  Top Layer w0.254: v1(11.34,22.51) 11.34,42.49 v1(11.32,42.5) ; 30.18,65.76 12.86,65.76 11.32,64.22 v1(11.32,44.28)
  Bottom Layer w0.254: v1(11.32,42.5) v1(11.32,44.28)
Y_IN: length 15.1
  Top Layer w0.254: LM358_L.5 40.14,69.17 C17.2 37.22,71.19 36.98,70.95 36.98,70.83 36.97,70.82 36.97,69.72 36.98,69.72 36.98,66.27 NPN_L.3 36.46,65.76 32.08,65.76
$1N2206: length 12.1
  Top Layer w0.254: NPN_L.1 35.52,62.12 36.09,61.55 43.33,61.55 44,62.22 R5.2
$1N2855: length 2.2
  Top Layer w0.254: R7.2 R6.1
$1N3044: length 1.7
  Top Layer w0.254: LM358_L.1 45.51,65.36 R5.1
$1N49015: length 7.4
  Top Layer w0.254: R1.1 52.18,67.6 TL431_L.2 TL431_L.1 50.25,68.22 49.61,68.86 R2.2
$1N49740: length 13.2
  Top Layer w0.254: 66.78,63.69 66.78,61.59 67.46,60.92 74.44,60.92 75.26,61.73 R22.2
$1N49741: length 2.2
  Top Layer w0.254: R24.2 R23.1
$1N49768: length 1.7
  Top Layer w0.254: R22.1 76.77,65.36 LM358_R.1
$1N49771: length 7.4
  Top Layer w0.254: R19.2 80.87,68.86 81.51,68.22 81.51,67.63 TL431_L1.2 83.44,67.6 R18.1
$1N53499: length 11.3
  Top Layer w0.254: NPN_L.2 38.29,62.82 40.78,62.82 R4.2 42.56,63.71 43.83,64.98 43.83,66.25 44.22,66.63 45.5,66.63
$1N53519: length 4.8
  Top Layer w0.254: R3.2 47.84,67.35 47.29,67.9 LM358_L.3
$1N53536: length 4.8
  Top Layer w0.254: R20.2 79.1,67.35 78.55,67.9 LM358_R.3
$1N53543: length 11
  Top Layer w0.254: 76.76,66.63 75.97,66.63 75.46,66.12 75.46,65.36 73.81,63.71 R21.2 72.04,62.82 69.55,62.82 NPN_L1.2
$1N65504: length 2.1
  Top Layer w0.254: v1(7.28,52.5) 7.28,54.57 R25.2

## Copper pours and planes (outline as drawn; the poured copper is in the pictures)
GND on Top Layer: -100.18,103.97 205,103.97 205,-5.25 -100.18,-5.25
GND on Bottom Layer: -4.93,169.37 104.79,169.37 104.79,-82.59 -4.93,-82.59

Small or netless copper shapes (teardrops, artwork), in the pictures only: 132 on Top Layer, 23 on Bottom Layer

## Text on the board
Bottom Silkscreen Layer: SDA | SCL | 3V3 | GND
